# Altium project CHARGE_PUMP_V2.PrjPcb
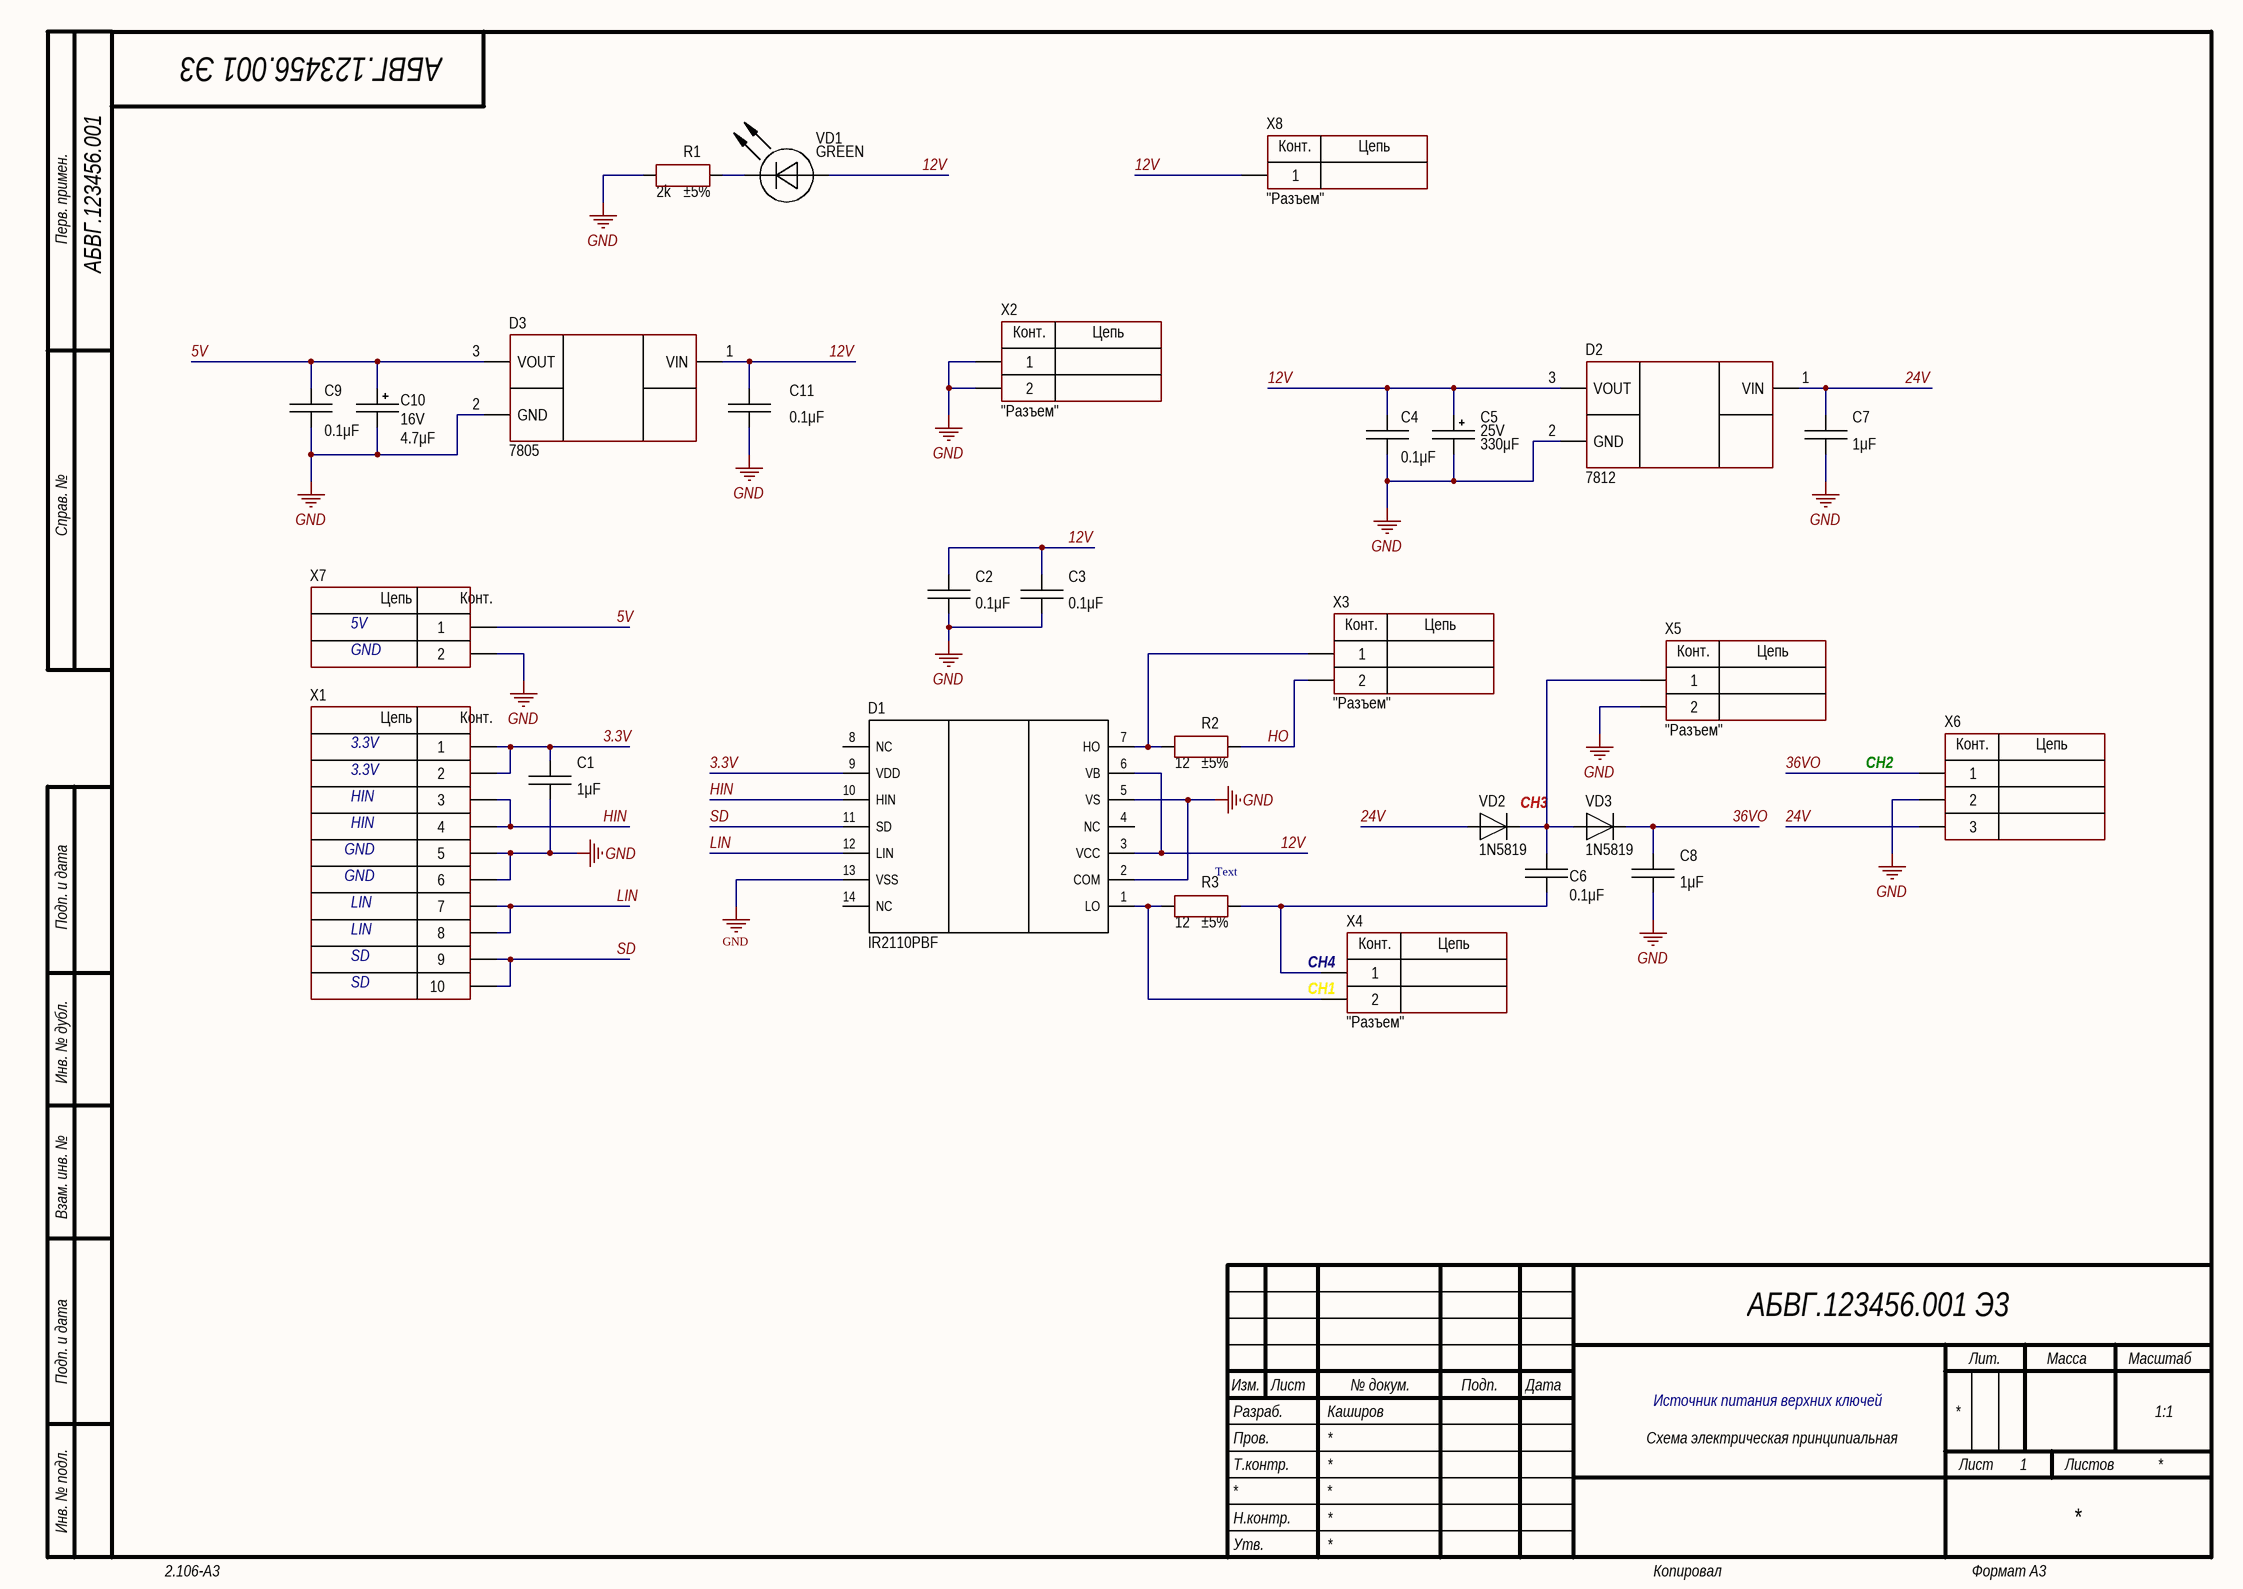
[diagram p0: Sheet1.SchDoc]
1 sheet, 28 parts. Net scope: global (net labels, ports and power ports of the same name join across sheets).
Board file: PCB1.PcbDoc

## Sheet Sheet1.SchDoc
size 420 x 297 mm; Author: Каширов; Address1: Address1; Address2: Address2; Address3: Address3; Address4: Address4; DocumentNumber: АБВГ.123456.001 Э3; SheetNumber: 1; Scale: 1:1; DocumentType: Схема электрическая принципиальная; FirstReferrence: АБВГ.123456.001

### Parts
C1  value 1μF  [CAP: HOLE 5mm]  (hidden comment: *)
C2  value 0.1μF  [CAP: 0805]
C3  value 0.1μF  [CAP: 0805]
C4  value 0.1μF  [CAP: HOLE 5mm]  (hidden comment: *)
C5  value 330μF  Voltage: 25V  [CAP: D6.3C2.5H11]
C6  value 0.1μF  [CAP: HOLE 5mm]  (hidden comment: *)
C7  value 1μF  [CAP: HOLE 5mm]  (hidden comment: *)
C8  value 1μF  [CAP: HOLE 5mm]  (hidden comment: *)
C9  value 0.1μF  [CAP: HOLE 5mm]  (hidden comment: *)
C10  value 4.7μF  Voltage: 16V  [CAP: TANTAL-A]
C11  value 0.1μF  [CAP: 0805]
D1  Infineon Technologies  [14-DIP]  (value not drawn)
D2  PartNumber: 7812  [TO-220F]  (hidden comment: *)
D3  PartNumber: 7805  [TO-220F]  (hidden comment: *)
R1  value 2k  Tolerance: ±5%  [RES: Axial 10mm]  (hidden comment: *)
R2  value 12  Tolerance: ±5%  [RES: Axial 10mm]  (hidden comment: *)
R3  value 12  Tolerance: ±5%  [RES: Axial 10mm]  (hidden comment: *)
VD1  Color: GREEN  [LED: Axial 3MM]
VD2  PartNumber: 1N5819  [DIODE: DO41]
VD3  PartNumber: 1N5819  [DIODE: DO41]
X1  (no value)  [CON: PLD-10]
X2  CommentText: "Разъем"  [CON: PLS-2]
X3  CommentText: "Разъем"  [CON: PLS-2]
X4  CommentText: "Разъем"  [CON: PLS-2]
X5  CommentText: "Разъем"  [CON: PLS-2]
X6  *  [CON: Terminal 3p 5mm]  (value not drawn)
X7  (no value)  [CON: PLS-2]
X8  CommentText: "Разъем"  [CON: PLS-1]

### Nets
GND: C1.1 C2.1 C3.1 C4.1 C5.2 C7.1 C8.1 C9.1 C10.2 C11.1 D1.2(COM) D1.5(VS) D1.13(VSS) D2.2(GND) D3.2(GND) R1.1 X1.5 X1.6 X2.1 X2.2 X5.2 X6.2 X7.2
3.3V: C1.2 D1.9(VDD) X1.1 X1.2
5V: C9.2 C10.1 D3.3(VOUT) X7.1
12V: C2.2 C3.2 C4.2 C5.1 C11.2 D1.3(VCC) D1.6(VB) D2.3(VOUT) D3.1(VIN) VD1.1(A) X8.1
24V: C7.2 D2.1(VIN) VD2.1 X6.3
36VO: C8.2 VD3.2 X6.1
HIN: D1.10(HIN) X1.3 X1.4
HO: R2.2 X3.2
LIN: D1.12(LIN) X1.7 X1.8
SD: D1.11(SD) X1.9 X1.10
NetC6_1: C6.1 VD2.2 VD3.1 X5.1
NetC6_2: C6.2 R3.2 X4.1
NetD1_1: D1.1(LO) R3.1 X4.2
NetD1_7: D1.7(HO) R2.1 X3.1
NetR1_2: R1.2 VD1.2(C)

Not connected (* = marked no-connect by the designer): D1 4(NC) 8(NC) 14(NC)

### Notes on the sheet
- 5V
- GND
- 3.3V
- HIN
- CH2
- (near VD2) CH3
- LIN
- (near R3) Text
- SD
- (near X4) CH1
- (near X4) CH4
- Источник питания верхних ключей
- Перв. примен.
- Справ. №
- Подп. и дата
- Инв. № дубл.
- Взам. инв. №
- Разраб.
- Изм.
- Лист
- № докум.
- Подп.
- Дата
- Лит.
- Масса
- Масштаб
- Пров.
- Т.контр.
- Листов
- Инв. № подл.
- Утв.
- Н.контр.
- 2.106-A3
- Копировал
- Формат А3
- (in symbol PLD-10) Цепь; Конт.
- (in symbol PLS-1) Конт.; Цепь
- (in symbol PLS-2) Конт.; Цепь
- (in symbol Terminal block 3) Конт.; Цепь

### Library data of the parts
C1 C4 C6-C9 = Ceramic: TypeCapacitor: Ceramic capacitor; Manufacturer: *; PartNumber: *; Package: *; HelpURL: *; ValueManufacturerPartNumber: *; Temperature: *; Tolerance: *; TypeDielectric: *; Voltage: *
C2 C3 C11 = Ceramic_0805: Manufacturer: Yageo; PartNumber: CC0805KRX7R7BB104; TypeCapacitor: Ceramic capacitor; Tolerance: ±10%; TypeDielectric: X7R; Package: 0805; HelpURL: https://www.digikey.com/product-detail/en/yageo/CC0805KRX7R7BB104/311-1142-1-ND/303052; ValueManufacturerPartNumber: =TypeCapacitor+', '+Value+', '+TypeDielectric+', '+Tolerance+', '+Voltage+', '+Package+', '+Temperature; Temperature: -55...+125°C
C5 = Aluminium: Manufacturer: Wurth; PartNumber: 860080475013; ValueManufacturerPartNumber: Aluminium capacitor, 330μF, 25V, ±20%, 54mOhm, 14x10x5 mm, -55...+105°C; TypeCapacitor: Aluminium capacitor; Tolerance: ±20%; Impedance: 54mOhm; Package: 14x10x5 mm; HelpURL: https://www.digikey.com/product-detail/en/wurth-electronics-inc/860080475013/732-9029-1-ND/5728972; Temperature: -55...+105°C
C10 = Tantal_A: Manufacturer: AVX; PartNumber: F930J107KAAAJ6; ValueManufacturerPartNumber: Tantalum capacitor, 4.7μF, 16V, ±10%, 2Ohm, case A (3216), -55...+125°C; Impedance: 2Ohm; Tolerance: ±10%; TypeDielectric: X7R; TypeCapacitor: Tantalum capacitor; Package: case A (3216); HelpURL: https://www.digikey.com/product-detail/en/avx-corporation/F930J107KAAAJ6/478-12404-1-ND/9645231; Temperature: -55...+125°C
D1 = IR2110PBF: Gate driver; Manufacturer: Infineon Technologies; HelpURL: https://www.digikey.com/product-detail/en/infineon-technologies/IR2110PBF/IR2110PBF-ND/811566; Package: DIP-14; ComponentType: Gate driver; PartNumber: IR2110PBF
D2 D3 = 78XX: Linear voltage regulator; Manufacturer: *; HelpURL: *; Package: *; ComponentType: Linear voltage regulator; ValueManufacturerPartNumber: *; Temperature: *; VoltageInput: *; MaxDropout: *; CurrentOutput: *; VoltageOutput: *
R1-R3 = Resistor_Axial: Manufacturer: *; PartNumber: *; Package: *; HelpURL: *; ValueManufacturerPartNumber: *; Temperature: *; TypeResistor: *; Power: *
VD1 = LED_single: ValueManufacturerPartNumber: LED, Green, *, *, *, -55...+150°C; TypeDiode: LED; Manufacturer: *; Package: *; HelpURL: *; Temperature: -55...+150°C; Current: *; VoltageDrop: *; PartNumber: *; ColorParameter: Green
VD2 VD3 = Diode_single: Manufacturer: STMicroelectronics; TypeDiode: Single diode; Voltage: 40V; Current: 1A; VoltageDrop: 550mV; Package: DO-41; HelpURL: https://www.digikey.com/product-detail/en/stmicroelectronics/1N5819/497-6610-1-ND/1865421; ValueManufacturerPartNumber: =TypeDiode+', '+Voltage+', '+Current+', '+VoltageDrop+', '+RecoveryTime+', '+Package+', '+Temperature; Temperature: 150°C (Max); RecoveryTime: =< 500ns
X1 = PLD-10: Manufacturer: Connfly; ValueManufacturerPartNumber: Connector, 10pin, 2.54mm, 500VAC, 3A; TypeConnector: Connector; VoltageMax: 500VAC; Pitch: 2.54mm; CurrentMax: 3A; Multichannel: 10pin; HelpURL: https://www.chipdip.ru/product/pld-10; PartNumber: PLD-10
X2-X5 X7 = PLS-2: Manufacturer: Connfly; ValueManufacturerPartNumber: Connector, 2pin, 2.54mm, 500VAC, 3A; TypeConnector: Connector; VoltageMax: 500VAC; Pitch: 2.54mm; CurrentMax: 3A; Multichannel: 2pin; HelpURL: https://www.chipdip.ru/product/pls-2; PartNumber: PLS-2
X6 = Terminal block 3: TypeConnector: Connector; Multichannel: 3pin; CommentText: "Разъем"; Manufacturer: *; HelpURL: *; ValueManufacturerPartNumber: *; PartNumber: *; VoltageMax: *; Pitch: *; CurrentMax: *
X8 = PLS-1: Manufacturer: Connfly; ValueManufacturerPartNumber: Connector, 1pin, 2.54mm, 500VAC, 3A; TypeConnector: Connector; VoltageMax: 500VAC; Pitch: 2.54mm; CurrentMax: 3A; Multichannel: 1pin; HelpURL: https://www.chipdip.ru/product/pls-2; PartNumber: PLS-1